# EAGLE schematic main_board (EAGLE 6.1)
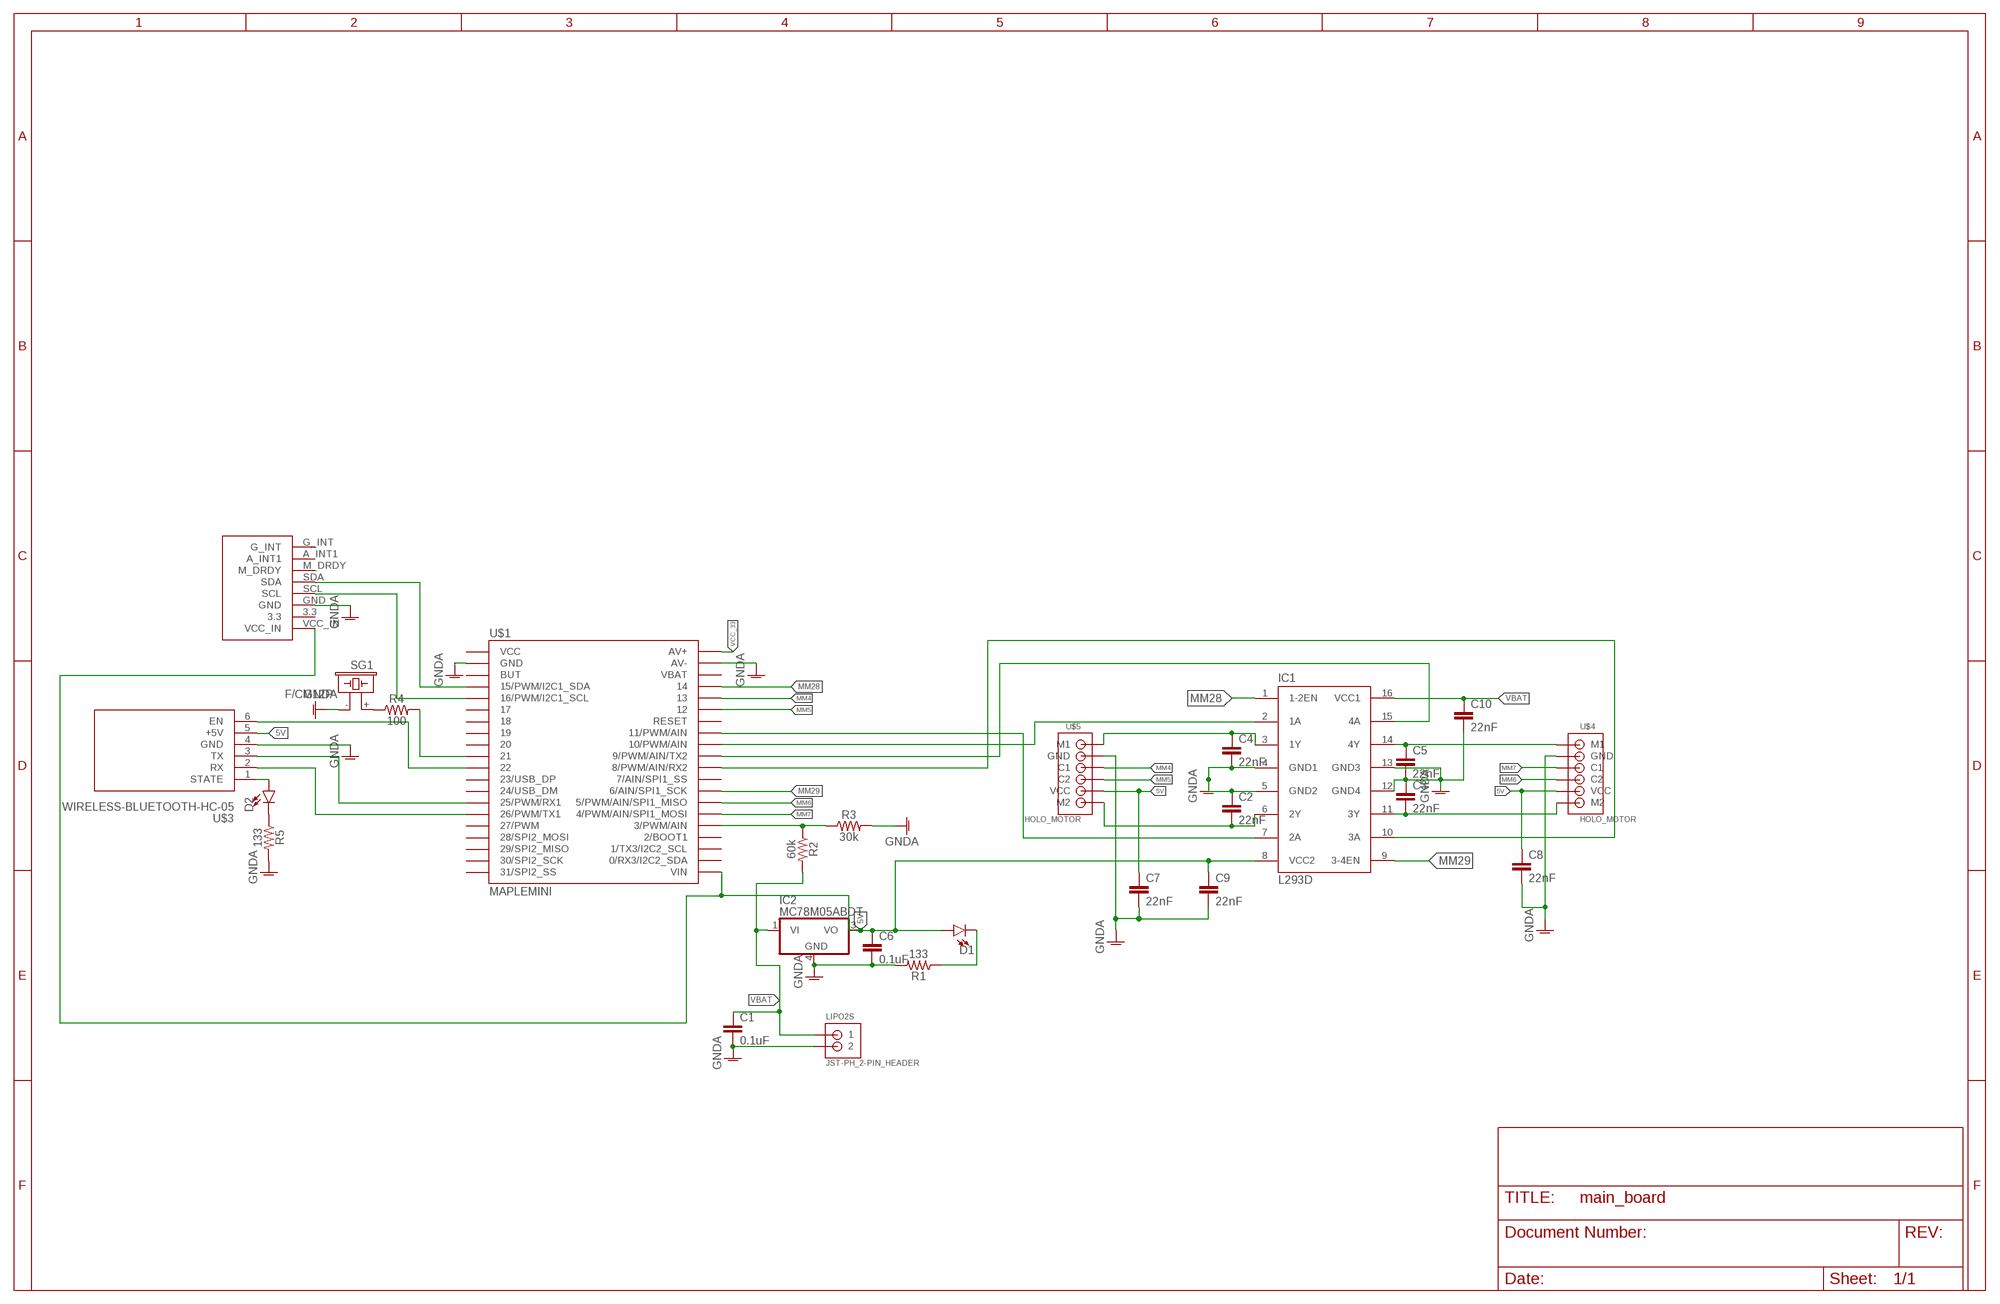
[diagram p0: schematic, sheet 1]

## Parts
C1  0.1uF  0.1UF-0603-25V-(+80/-20%)  [0603]
C2  22nF  22NF/22,000PF-0603-50V-10%  [0603]
C3  22nF  22NF/22,000PF-0603-50V-10%  [0603]
C4  22nF  22NF/22,000PF-0603-50V-10%  [0603]
C5  22nF  22NF/22,000PF-0603-50V-10%  [0603]
C6  0.1uF  0.1UF-0603-25V-(+80/-20%)  [0603]
C7  22nF  22NF/22,000PF-0603-50V-10%  [0603]
C8  22nF  22NF/22,000PF-0603-50V-10%  [0603]
C9  22nF  22NF/22,000PF-0603-50V-10%  [0603]
C10  22nF  22NF/22,000PF-0603-50V-10%  [0603]
D1  LED-FKIT-1206  [FKIT-LED-1206]
D2  LED-FKIT-1206  [FKIT-LED-1206]
IC1  L293D  [DIL16]
IC2  MC78M05ABDT  [DPACK_3]
LIPO2S  JST-PH_2-PIN_HEADER  [JST_B2B-PH_HEADER]
R1  133  0.27OHM-0603-1/10W-1%  [0603]
R2  60k  0.27OHM-0603-1/10W-1%  [0603]
R3  30k  0.27OHM-0603-1/10W-1%  [0603]
R4  100  0.27OHM-0603-1/10W-1%  [0603]
R5  133  0.27OHM-0603-1/10W-1%  [0603]
SG1  F/CM12P  [F/CM12P]
U$1  MAPLEMINI  [20-DIP]
U$3  WIRELESS-BLUETOOTH-HC-05  [WIRELESS-BLUETOOTH-HC-05]
U$4  HOLO_MOTOR  [HOLO_MOTOR]
U$5  HOLO_MOTOR  [HOLO_MOTOR]
U$6  GY-85  [GY-85]

## Nets
5V: C6.1 C7.1 C8.1 C9.1 D1.A IC1.8(VCC2) IC2.3(VO) U$1.21(VIN) U$3.5(+5V) U$4.5(VCC) U$5.5(VCC) U$6.VCC_IN
GNDA: C1.2 C2.1 C3.1 C4.2 C5.2 C6.2 C7.2 C8.2 C9.2 C10.2 IC1.4(GND1) IC1.5(GND2) IC1.12(GND4) IC1.13(GND3) IC2.4(GND) LIPO2S.P2 R1.2 R3.2 R5.2 SG1.- U$1.2(GND) U$1.39(AV-) U$3.4(GND) U$4.2(GND) U$5.2(GND) U$6.GND
MM4: U$1.36 U$5.3(C1)
MM5: U$1.35 U$5.4(C2)
MM6: U$1.27(5/PWM/AIN/SPI1_MISO) U$4.4(C2)
MM7: U$1.26(4/PWM/AIN/SPI1_MOSI) U$4.3(C1)
MM28: IC1.1(1-2EN) U$1.37
MM29: IC1.9(3-4EN) U$1.28(6/AIN/SPI1_SCK)
N$1: D1.C R1.1
N$2: R4.2 U$1.10
N$3: IC1.10(3A) U$1.30(8/PWM/AIN/RX2)
N$4: U$1.15(26/PWM/TX1) U$3.2(RX)
N$5: U$1.14(25/PWM/RX1) U$3.3(TX)
N$6: U$1.5(16/PWM/I2C1_SCL) U$6.SCL
N$7: C5.1 IC1.14(4Y) U$4.1(M1)
N$8: U$1.11 U$3.6(EN)
N$9: R2.1 R3.1 U$1.25(3/PWM/AIN)
N$10: IC1.7(2A) U$1.33(11/PWM/AIN)
N$11: IC1.2(1A) U$1.32(10/PWM/AIN)
N$12: IC1.15(4A) U$1.31(9/PWM/AIN/TX2)
N$13: U$1.4(15/PWM/I2C1_SDA) U$6.SDA
N$14: R4.1 SG1.+
N$15: C4.1 IC1.3(1Y) U$5.1(M1)
N$16: C3.2 IC1.11(3Y) U$4.6(M2)
N$17: C2.2 IC1.6(2Y) U$5.6(M2)
N$18: D2.A U$3.1(STATE)
N$19: D2.C R5.1
VBAT: C1.1 C10.1 IC1.16(VCC1) IC2.1(VI) LIPO2S.P1 R2.2
VCC_33: U$1.40(AV+)
Unconnected: U$1.1(VCC) U$1.3(BUT) U$1.6 U$1.7 U$1.8 U$1.9 U$1.12(23/USB_DP) U$1.13(24/USB_DM) U$1.16(27/PWM) U$1.17(28/SPI2_MOSI) U$1.18(29/SPI2_MISO) U$1.19(30/SPI2_SCK) U$1.20(31/SPI2_SS) U$1.22(0/RX3/I2C2_SDA) U$1.23(1/TX3/I2C2_SCL) U$1.24(2/BOOT1) U$1.29(7/AIN/SPI1_SS) U$1.34(RESET) U$1.38(VBAT) U$6.3.3 U$6.A_INT1 U$6.G_INT U$6.M_DRDY

## Library data of the parts
C1 C6 = SparkFun-Capacitors:0.1UF: 0.1µF ceramic capacitors A capacitor is a passive two-terminal electrical component used to store electrical energy temporarily in an electric field.; PROD_ID: CAP-00810
C2-C5 C7-C10 = SparkFun-Capacitors:22NF/22,000PF: 0.022uF/22nF/22,000pF ceramic capacitors A capacitor is a passive two-terminal electrical component used to store electrical energy temporarily in an electric field.; PROD_ID: CAP-07885
D1 D2 = SparkFun-LED:LED: LED (Generic) Standard schematic elements and footprints for 5mm, 3mm, 1206, and 0603 sized LEDs. Generic LEDs with no color specified.
IC1 = st-microelectronics:L293D: PUSH-PULL 4 CHANNEL DRIVER; MPN: L293D; OC_FARNELL: 9589619; OC_NEWARK: 56P8249
IC2 = linear:MC78M: 500 mA Positive Voltage Regulators Source: Data sheet <http://www.onsemi.com/pub_link/Collateral/MC78M00-D.PDF>
LIPO2S = srg:JST-PH_2-PIN_HEADER: 2-pin JST PH Shrouded Header, top entry P/N B2B-PH-K-S Mating connector PHR-2 Mating cable assembly: Sparkfun PRT-09914 <http://www.sparkfun.com/products/9914>
R1-R5 = SparkFun-Resistors:0.27OHM: 0.27Ω resistor A resistor is a passive two-terminal electrical component that implements electrical resistance as a circuit element. Resistors act to reduce current flow, and, at the same time, act to lower voltage levels within circuits. - Wikipedia; PROD_ID: RES-08787; VALUE: 0.27
SG1 = buzzer:F/CM12P: BUZZER Source: Buerklin; OC_FARNELL: unknown; OC_NEWARK: unknown
U$1 = maplemini:MAPLEMINI
U$3 = diy-modules:WIRELESS-BLUETOOTH-HC-05: Bluetooth Transceiver Module based on HC-05 board Tutorial is available here: https://arduino-info.wikispaces.com/BlueTooth-HC05-HC06-Modules-How-To Click here to find device on ebay.com <http://www.ebay.com/sch/hc-05+module+rs232>
U$4 U$5 = jst:HOLO_MOTOR
U$6 = rhoban:GY-85